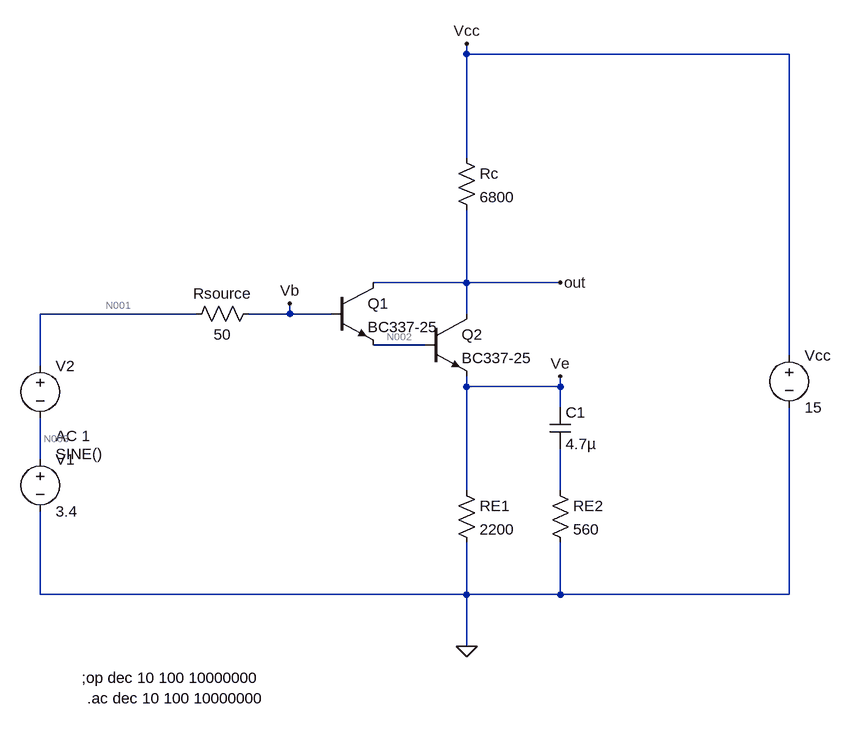
[diagram p0: schematic Draft1.asc]
Draft1.asc, the LTspice schematic file:
Version 4
SHEET 1 916 720
WIRE 352 -288 352 -304
WIRE 848 -288 352 -288
WIRE 352 -128 352 -288
WIRE 352 64 352 -48
WIRE 352 64 208 64
WIRE 496 64 352 64
WIRE -64 112 -304 112
WIRE 80 112 80 96
WIRE 80 112 16 112
WIRE 144 112 80 112
WIRE 352 112 352 64
WIRE 288 160 208 160
WIRE 848 176 848 -288
WIRE -304 192 -304 112
WIRE 352 224 352 208
WIRE 496 224 496 208
WIRE 496 224 352 224
WIRE 496 256 496 224
WIRE -304 336 -304 272
WIRE 352 384 352 224
WIRE 496 384 496 320
WIRE -304 544 -304 416
WIRE 352 544 352 464
WIRE 352 544 -304 544
WIRE 496 544 496 464
WIRE 496 544 352 544
WIRE 848 544 848 256
WIRE 848 544 496 544
WIRE 352 624 352 544
FLAG 352 624 0
FLAG 496 64 out
FLAG 352 -304 Vcc
FLAG 496 208 Ve
FLAG 80 96 Vb
SYMBOL npn 144 64 R0
SYMATTR InstName Q1
SYMATTR Value BC337-25
SYMBOL npn 288 112 R0
SYMATTR InstName Q2
SYMATTR Value BC337-25
SYMBOL res 336 -144 R0
SYMATTR InstName Rc
SYMATTR Value 6800
SYMBOL res 336 368 R0
SYMATTR InstName RE1
SYMATTR Value 2200
SYMBOL res 480 368 R0
SYMATTR InstName RE2
SYMATTR Value 560
SYMBOL cap 480 256 R0
SYMATTR InstName C1
SYMATTR Value 4.7µ
SYMBOL res 32 96 R90
WINDOW 0 0 56 VBottom 2
WINDOW 3 32 56 VTop 2
SYMATTR InstName Rsource
SYMATTR Value 50
SYMBOL voltage -304 320 R0
WINDOW 123 0 0 Left 0
WINDOW 39 0 0 Left 0
SYMATTR InstName V1
SYMATTR Value 3.4
SYMBOL voltage -304 176 R0
WINDOW 3 24 152 Left 2
WINDOW 123 24 124 Left 2
WINDOW 39 0 0 Left 0
SYMATTR InstName V2
SYMATTR Value SINE()
SYMATTR Value2 AC 1
SYMBOL voltage 848 160 R0
WINDOW 123 0 0 Left 0
WINDOW 39 0 0 Left 0
SYMATTR InstName Vcc
SYMATTR Value 15
TEXT -240 672 Left 2 !;op dec 10 100 10000000
TEXT -232 704 Left 2 !.ac dec 10 100 10000000

The netlist it stands for:
* Draft1.asc
Q1 out Vb N002 0 BC337-25
Q2 out N002 Ve 0 BC337-25
Rc Vcc out 6800
RE1 Ve 0 2200
RE2 N004 0 560
C1 Ve N004 4.7µ
Rsource Vb N001 50
V1 N003 0 3.4
V2 N001 N003 SINE() AC 1
Vcc Vcc 0 15
.model NPN NPN
.model PNP PNP
.lib standard.bjt
;op dec 10 100 10000000
.ac dec 10 100 10000000
.backanno
.end

* Results of the author's LTspice run, read from the files saved beside the schematic
* Operating Point, zero values left out:
*   V(out) = 7.811 V
*   V(vb) = 3.4 V
*   V(n002) = 2.935 V
*   V(ve) = 2.326 V
*   V(vcc) = 15 V
*   V(n001) = 3.4 V
*   V(n003) = 3.4 V
*   Ic(Q2) = 1.053 mA
*   Ib(Q2) = 3.728 µA
*   Ie(Q2) = -1.057 mA
*   Ic(Q1) = 3.713 µA
*   Ib(Q1) = 14.76 nA
*   Ie(Q1) = -3.728 µA
*   I(Rsource) = -14.76 nA
*   I(Re1) = 1.057 mA
*   I(Rc) = 1.057 mA
*   I(Vcc) = -1.057 mA
*   I(V2) = -14.76 nA
*   I(V1) = -14.76 nA
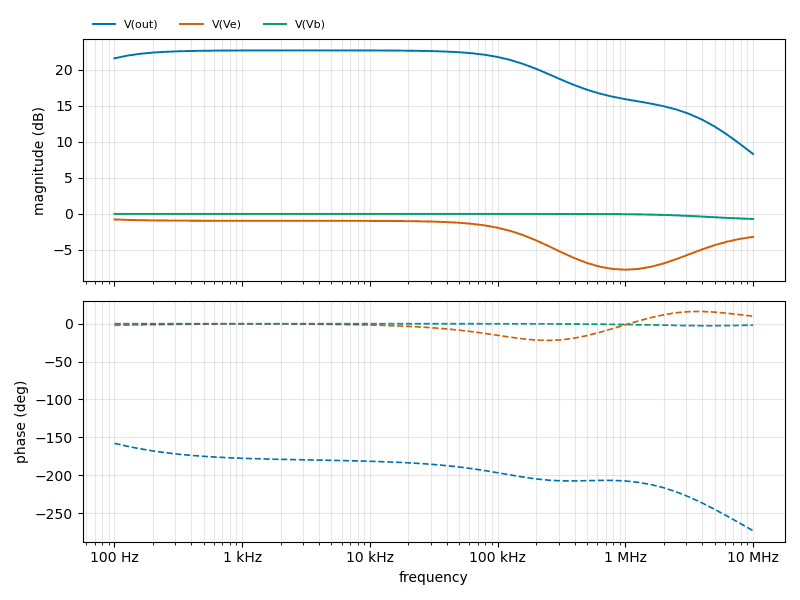
[diagram p1: AC Analysis of Draft1.asc, plotted from the saved traces]
* AC Analysis, 1 run:
*   V(out): 21.60 dB at 100 Hz, 8.32 dB at 10 MHz, peak 22.70 dB at 3.162 kHz, 3 dB below the peak at 230 kHz
*   V(Ve): -0.77 dB at 100 Hz, -3.18 dB at 10 MHz, peak -0.77 dB at 100 Hz, 3 dB below the peak at 206.2 kHz
*   V(Vb): -0.00 dB at 100 Hz, -0.70 dB at 10 MHz, peak -0.00 dB at 100 Hz